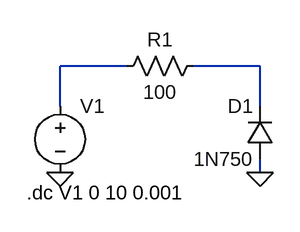
[diagram p0: schematic 09A-13.asc]
09A-13.asc, the LTspice schematic file:
Version 4.1
SHEET 1 880 680
WIRE 208 80 128 80
WIRE 368 80 288 80
WIRE 128 128 128 80
WIRE 368 128 368 80
WIRE 368 208 368 192
FLAG 128 208 0
FLAG 368 208 0
SYMBOL voltage 128 112 R0
WINDOW 123 0 0 Left 0
WINDOW 39 0 0 Left 0
SYMATTR InstName V1
SYMATTR Value ""
SYMBOL diode 384 192 R180
WINDOW 0 24 64 Left 2
WINDOW 3 24 0 Left 2
SYMATTR InstName D1
SYMATTR Value 1N750
SYMATTR Description Diode
SYMATTR Type diode
SYMBOL res 304 64 R90
WINDOW 0 0 56 VBottom 2
WINDOW 3 32 56 VTop 2
SYMATTR InstName R1
SYMATTR Value 100
TEXT 88 232 Left 2 !.dc V1 0 10 0.001

The netlist it stands for:
* 09A-13.asc
V1 N001 0
D1 0 N002 1N750
R1 N002 N001 100
.model D D
.lib standard.dio
.dc V1 0 10 0.001
.backanno
.end